# Altium schematic sheet Block_control.SchDoc
size 594 x 420 mm; SheetNumber: 1; SheetTotal: 1; PageSetup: Record=PageOptions|CenterHorizontal=True|CenterVertical=True|PrintScale=0.94|XCorrection=1.00|YCorrection=1.00|PrintKind=1|BorderSize=5000000|LeftOffset=0|BottomOffset=0|Orientation=1|PaperLength=1000|PaperWidth=1000|Scale=100|PaperSource=7|PrintQuality=-4|MediaType=1|DitherType=10|PaperKind=A4|PrintScaleMode=1; DecimalNumber: СМ7.82.00.00.00; HeadOfSector: Нач. сектора; MainDevice: Перв.примен.; Name: dffdfd; t_kontr: Т. контр; n_kontr: Н.Контр; lit_A: О; Name2: Наименование2; ListNumber: 1; Обозначение: СМ7.82.00.00.00 Э3; Наименование3: Схема электрическая принципиальная; Наименование1: Плата управления; Наименование2: приводами колес; Компания1: МГТУ им. Н. Э. Баумана; Компания2: группа СМ7-82Б; Разработал: Галиулин Н. С.; Проверил: Бошляков А. А.
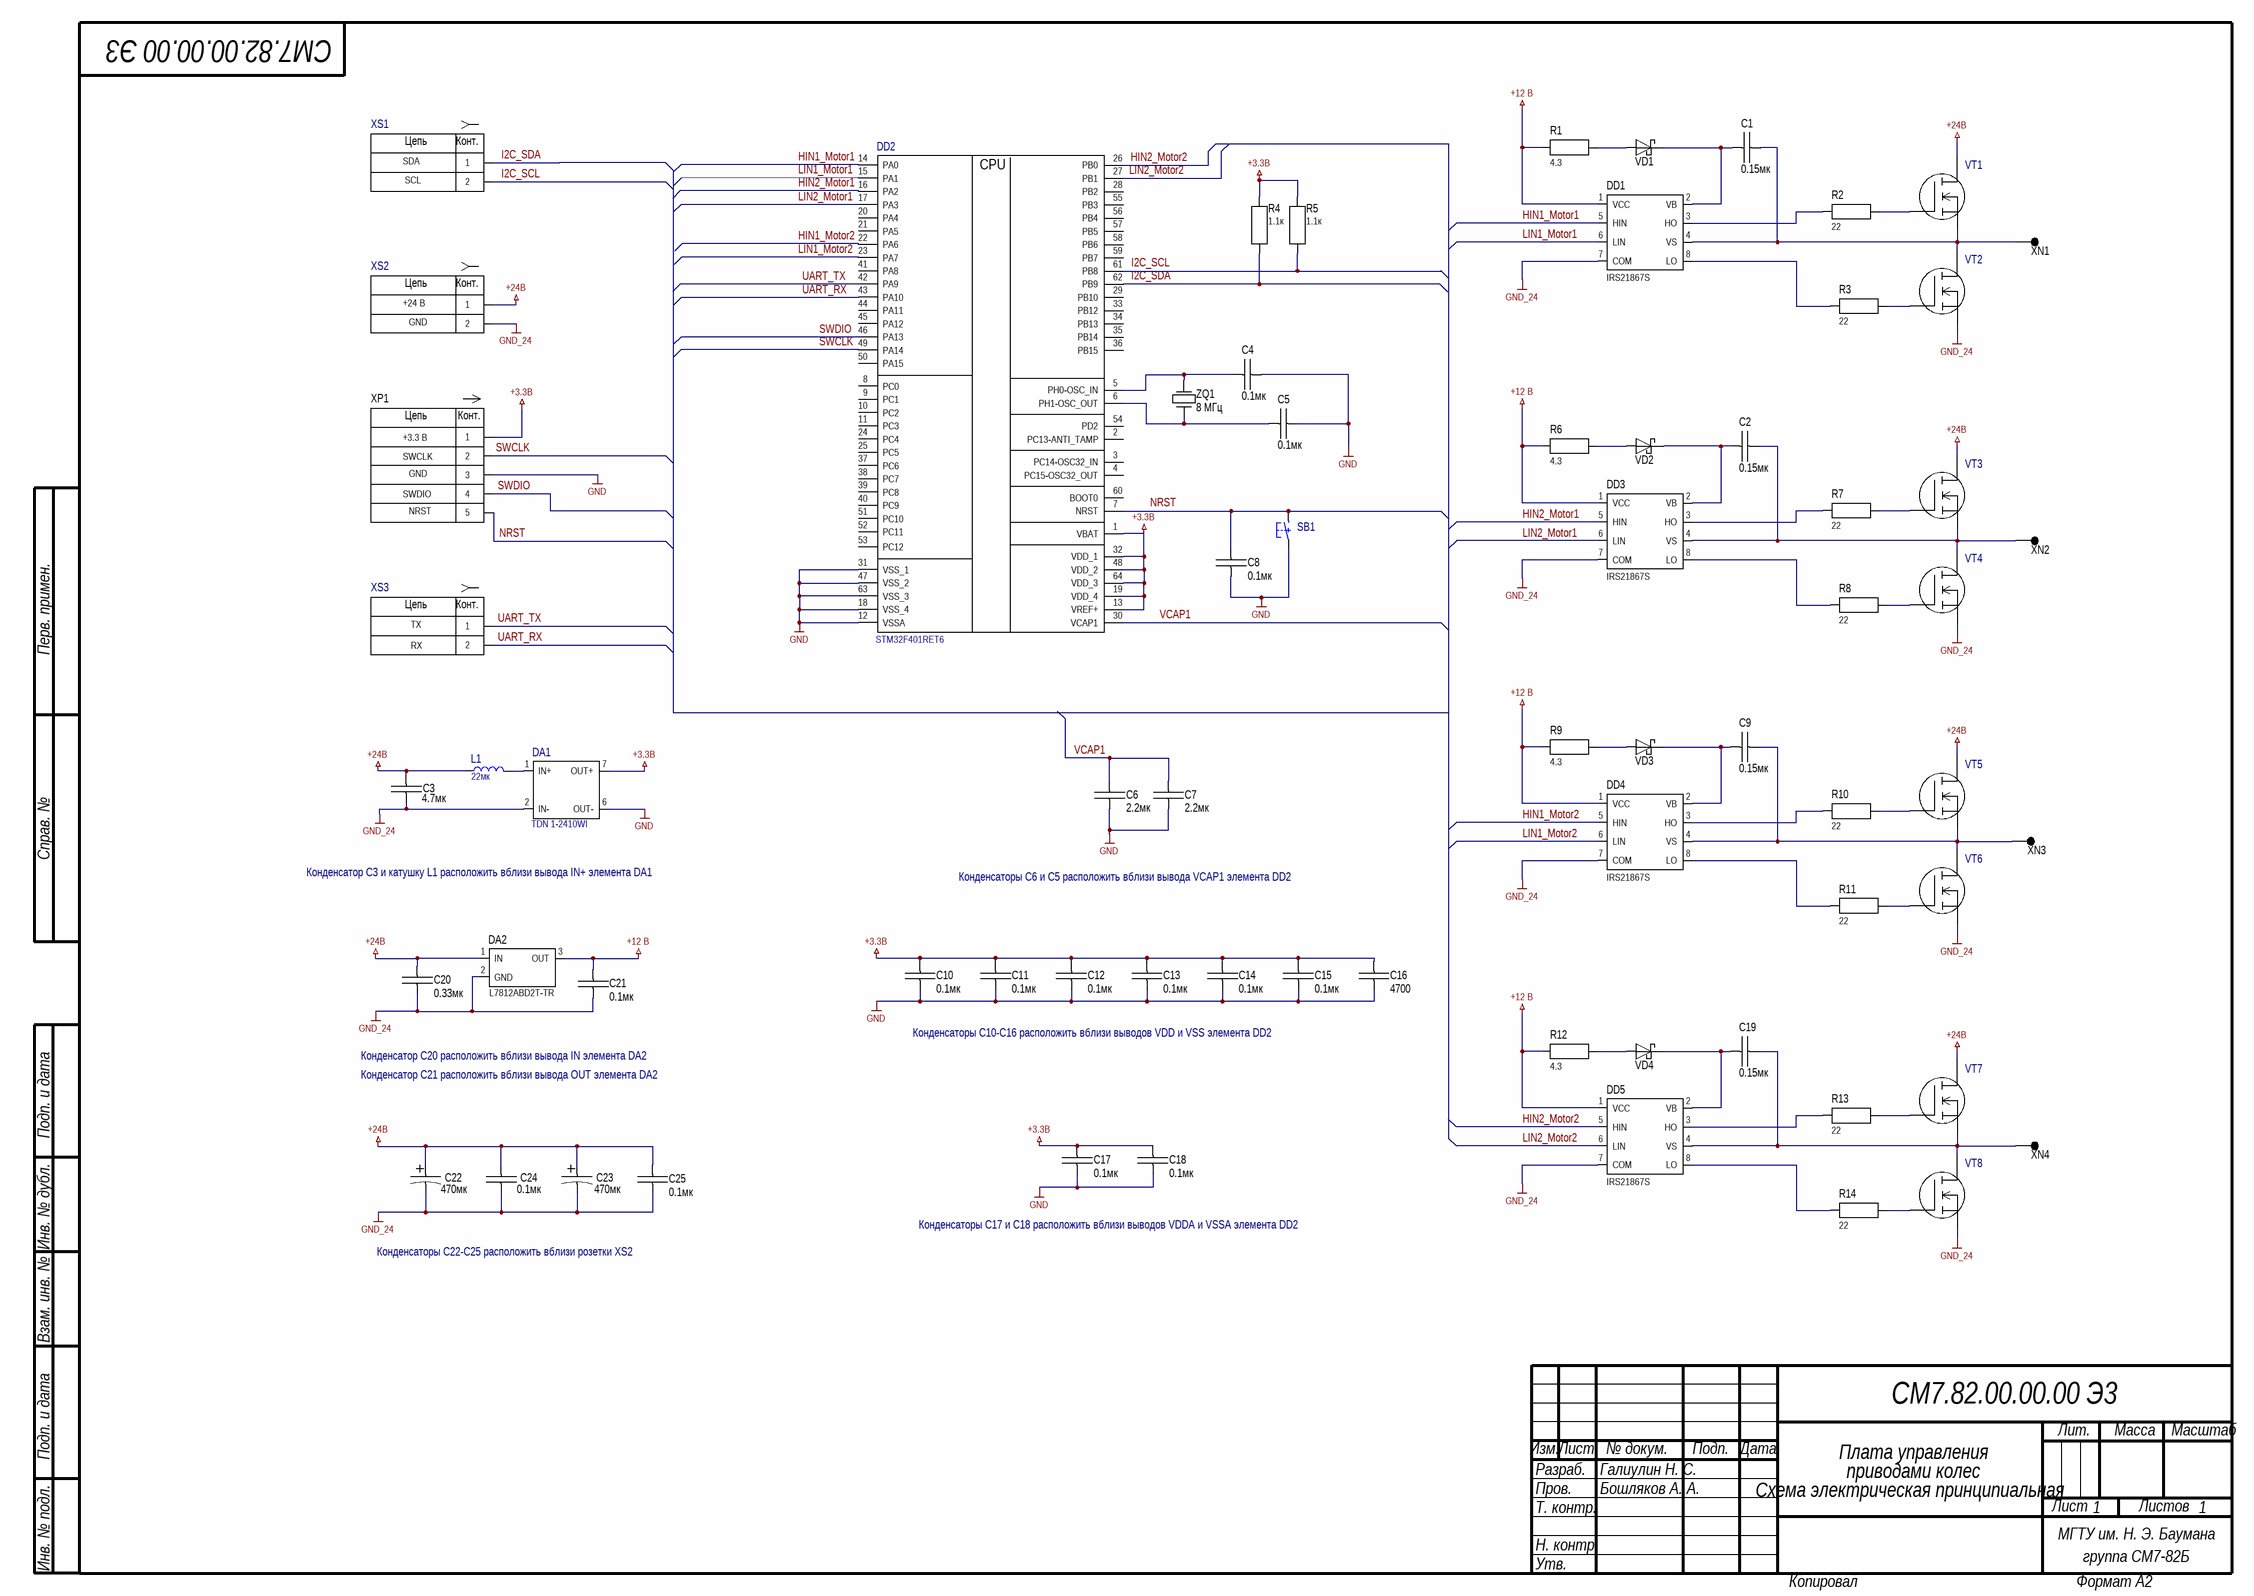
[diagram p0: Block_control.SchDoc]

## Parts
C1  value 0.15мк  [0603 Capicator]  (hidden comment: Cap_ceramica_SMD)
C2  value 0.15мк  [0603 Capicator]  (hidden comment: Cap_ceramica_SMD)
C3  value 4.7мк  [1206 Capacitor]  (hidden comment: Cap_ceramica_SMD)
C4  value 0.1мк  [0603 Capicator]  (hidden comment: Cap_ceramica_SMD)
C5  value 0.1мк  [0603 Capicator]  (hidden comment: Cap_ceramica_SMD)
C6  value 2.2мк  [0603 Capicator]  (hidden comment: Cap_ceramica_SMD)
C7  value 2.2мк  [0603 Capicator]  (hidden comment: Cap_ceramica_SMD)
C8  value 0.1мк  [0603 Capicator]  (hidden comment: Cap_ceramica_SMD)
C9  value 0.15мк  [0603 Capicator]  (hidden comment: Cap_ceramica_SMD)
C10  value 0.1мк  [0603 Capicator]  (hidden comment: Cap_ceramica_SMD)
C11  value 0.1мк  [0603 Capicator]  (hidden comment: Cap_ceramica_SMD)
C12  value 0.1мк  [0603 Capicator]  (hidden comment: Cap_ceramica_SMD)
C13  value 0.1мк  [0603 Capicator]  (hidden comment: Cap_ceramica_SMD)
C14  value 0.1мк  [0603 Capicator]  (hidden comment: Cap_ceramica_SMD)
C15  value 0.1мк  [0603 Capicator]  (hidden comment: Cap_ceramica_SMD)
C16  value 4700  [0603 Capicator]  (hidden comment: Cap_ceramica_SMD)
C17  value 0.1мк  [0603 Capicator]  (hidden comment: Cap_ceramica_SMD)
C18  value 0.1мк  [0603 Capicator]  (hidden comment: Cap_ceramica_SMD)
C19  value 0.15мк  [0603 Capicator]  (hidden comment: Cap_ceramica_SMD)
C20  value 0.33мк  [0603 Capicator]  (hidden comment: Cap_ceramica_SMD)
C21  value 0.1мк  [0603 Capicator]  (hidden comment: Cap_ceramica_SMD)
C22  470мк  [ECAP 8x16mm]
C23  470мк  [ECAP 8x16mm]
C24  value 0.1мк  [CAP: 0805 MIN_SILK]  (hidden comment: Cap_ceramica_SMD)
C25  value 0.1мк  [CAP: 0805 MIN_SILK]  (hidden comment: Cap_ceramica_SMD)
DA1  TDN 1-2410WI  [TDN 1-2410WI]
DA2  L7812ABD2T-TR  [D2-PAK (TO-262)]
DD1  Part Number: IRS21867S  [8-SOIC]  (hidden comment: IR2011STRPBF)
DD2  STM32F401RET6  [LQFP64]
DD3  Part Number: IRS21867S  [8-SOIC]  (hidden comment: IR2011STRPBF)
DD4  Part Number: IRS21867S  [8-SOIC]  (hidden comment: IR2011STRPBF)
DD5  Part Number: IRS21867S  [8-SOIC]  (hidden comment: IR2011STRPBF)
L1  22мк  [SDR]
R1  value 4.3  [RES: 0603 Min_Silk]  (hidden comment: 4.7)
R2  value 22  [RES: 0603 Min_Silk]  (hidden comment: 27)
R3  value 22  [RES: 0603 Min_Silk]  (hidden comment: 27)
R4  value 1.1к  [RES: 0603 Min_Silk]  (hidden comment: 27)
R5  value 1.1к  [RES: 0603 Min_Silk]  (hidden comment: 27)
R6  value 4.3  [RES: 0603 Min_Silk]  (hidden comment: 4.7)
R7  value 22  [RES: 0603 Min_Silk]  (hidden comment: 27)
R8  value 22  [RES: 0603 Min_Silk]  (hidden comment: 27)
R9  value 4.3  [RES: 0603 Min_Silk]  (hidden comment: 4.7)
R10  22  [RES: 0603 Min_Silk]
R11  22  [RES: 0603 Min_Silk]
R12  value 4.3  [RES: 0603 Min_Silk]  (hidden comment: 4.7)
R13  22  [RES: 0603 Min_Silk]
R14  22  [RES: 0603 Min_Silk]
SB1  But  [BUTTON 6x3.5]  (value not drawn)
VD1  Schottky Diode  [DIODE: SOD123LF]  (value not drawn)
VD2  Schottky Diode  [DIODE: SOD123LF]  (value not drawn)
VD3  Schottky Diode  [DIODE: SOD123LF]  (value not drawn)
VD4  Schottky Diode  [DIODE: SOD123LF]  (value not drawn)
VT1  IRL3705ZPBF  [TO-220]  (value not drawn)
VT2  IRL3705ZPBF  [TO-220]  (value not drawn)
VT3  IRL3705ZPBF  [TO-220]  (value not drawn)
VT4  IRL3705ZPBF  [TO-220]  (value not drawn)
VT5  IRL3705ZPBF  [TO-220]  (value not drawn)
VT6  IRL3705ZPBF  [TO-220]  (value not drawn)
VT7  IRL3705ZPBF  [TO-220]  (value not drawn)
VT8  IRL3705ZPBF  [TO-220]  (value not drawn)
XN1  Soldered connector  [CON: Pad 3mm]  (value not drawn)
XN2  Soldered connector  [CON: Pad 3mm]  (value not drawn)
XN3  Soldered connector  [CON: Pad 3mm]  (value not drawn)
XN4  Soldered connector  [CON: Pad 3mm]  (value not drawn)
XP1  Pin 4: GND  Pin 3: SWCLK  Pin 2: SWDIO  Pin 1: +3.3 В  [PLS 5x1]  (hidden comment: DS1021-1x5)
XS1  Micro-Fit 3.0  [MolexMicroFit 2x1]  (value not drawn)
XS2  Micro-Fit 3.0  [MolexMicroFit 2x1]  (value not drawn)
XS3  SCT1251WV-2P  [Con UART]  (value not drawn)
ZQ1  value 8 МГц  [R38]  (hidden comment: Oscillator (4 pin, 2 use))

## Nets
+3.3В: C10.2 C11.2 C12.2 C13.2 C14.2 C15.2 C16.2 C17.2 C18.2 DA1.7(OUT+) DD2.1(VBAT) DD2.13(VREF+) DD2.19(VDD_4) DD2.32(VDD_1) DD2.48(VDD_2) DD2.64(VDD_3) R4.2 R5.2 XP1.1
+12 В: C21.2 DA2.3(OUT) DD1.1(VCC) DD3.1(VCC) DD4.1(VCC) DD5.1(VCC) R1.1 R6.1 R9.1 R12.1
+24В: C3.2 C20.2 C22.2 C23.2 C24.2 C25.2 DA2.1(IN) L1.1 VT1.3(D1.1) VT3.3(D1.1) VT5.3(D1.1) VT7.3(D1.1) XS2.1
GND: C4.2 C5.2 C6.1 C7.1 C8.1 C10.1 C11.1 C12.1 C13.1 C14.1 C15.1 C16.1 C17.1 C18.1 DA1.6(OUT-) DD2.12(VSSA) DD2.18(VSS_4) DD2.31(VSS_1) DD2.47(VSS_2) DD2.63(VSS_3) SB1.1 XP1.3
GND_24: C3.1 C20.1 C21.1 C22.1 C23.1 C24.1 C25.1 DA1.2(IN-) DA2.2(GND) DD1.7(COM) DD3.7(COM) DD4.7(COM) DD5.7(COM) VT2.2(S1) VT4.2(S1) VT6.2(S1) VT8.2(S1) XS2.2
HIN1_Motor1: DD1.5(HIN) DD2.14(PA0)
HIN1_Motor2: DD2.22(PA6) DD4.5(HIN)
HIN2_Motor1: DD2.16(PA2) DD3.5(HIN)
HIN2_Motor2: DD2.26(PB0) DD5.5(HIN)
I2C_SCL: XS1.2
I2C_SDA: XS1.1
LIN1_Motor1: DD1.6(LIN) DD2.15(PA1)
LIN1_Motor2: DD2.23(PA7) DD4.6(LIN)
LIN2_Motor1: DD2.17(PA3) DD3.6(LIN)
LIN2_Motor2: DD2.27(PB1) DD5.6(LIN)
NRST: XP1.5
SWCLK: DD2.49(PA14) XP1.2
SWDIO: DD2.46(PA13) XP1.4
UART_RX: DD2.43(PA10) XS3.2
UART_TX: DD2.42(PA9) XS3.1
VCAP1: C6.2 C7.2 DD2.30(VCAP1)
NetC1_1: C1.1 DD1.2(VB) VD1.1
NetC1_2: C1.2 DD1.4(VS) VT1.2(S1) VT2.3(D1.1) XN1.1
NetC2_1: C2.1 DD3.2(VB) VD2.1
NetC2_2: C2.2 DD3.4(VS) VT3.2(S1) VT4.3(D1.1) XN2.1
NetC4_1: C4.1 DD2.5(PH0-OSC_IN) ZQ1.2
NetC5_1: C5.1 DD2.6(PH1-OSC_OUT) ZQ1.1
NetC8_2: C8.2 DD2.7(NRST) SB1.2
NetC9_1: C9.1 DD4.2(VB) VD3.1
NetC9_2: C9.2 DD4.4(VS) VT5.2(S1) VT6.3(D1.1) XN3.1
NetC19_1: C19.1 DD5.2(VB) VD4.1
NetC19_2: C19.2 DD5.4(VS) VT7.2(S1) VT8.3(D1.1) XN4.1
NetDA1_1: DA1.1(IN+) L1.2
NetDD1_3: DD1.3(HO) R2.1
NetDD1_8: DD1.8(LO) R3.1
NetDD2_61: DD2.61(PB8) R5.1
NetDD2_62: DD2.62(PB9) R4.1
NetDD3_3: DD3.3(HO) R7.1
NetDD3_8: DD3.8(LO) R8.1
NetDD4_3: DD4.3(HO) R10.1
NetDD4_8: DD4.8(LO) R11.1
NetDD5_3: DD5.3(HO) R13.1
NetDD5_8: DD5.8(LO) R14.1
NetR1_2: R1.2 VD1.2
NetR2_2: R2.2 VT1.1(G1)
NetR3_2: R3.2 VT2.1(G1)
NetR6_2: R6.2 VD2.2
NetR7_2: R7.2 VT3.1(G1)
NetR8_2: R8.2 VT4.1(G1)
NetR9_2: R9.2 VD3.2
NetR10_2: R10.2 VT5.1(G1)
NetR11_2: R11.2 VT6.1(G1)
NetR12_2: R12.2 VD4.2
NetR13_2: R13.2 VT7.1(G1)
NetR14_2: R14.2 VT8.1(G1)

Not connected (* = marked no-connect by the designer): DD2 2(PC13-ANTI_TAMP) 3(PC14-OSC32_IN) 4(PC15-OSC32_OUT) 8(PC0) 9(PC1) 10(PC2) 11(PC3) 20(PA4) 21(PA5) 24(PC4) 25(PC5) 28(PB2) 29(PB10) 33(PB12) 34(PB13) 35(PB14) 36(PB15) 37(PC6) 38(PC7) 39(PC8) 40(PC9) 41(PA8) 44(PA11) 45(PA12) 50(PA15) 51(PC10) 52(PC11) 53(PC12) 54(PD2) 55(PB3) 56(PB4) 57(PB5) 58(PB6) 59(PB7) 60(BOOT0)

## Notes on the sheet
- Конденсатор C3 и катушку L1 расположить вблизи вывода IN+ элемента DA1
- Конденсаторы C6 и С5 расположить вблизи вывода VCAP1 элемента DD2
- Конденсатор C20 расположить вблизи вывода IN элемента DA2
- Конденсатор C21 расположить вблизи вывода OUT элемента DA2
- Конденсаторы C10-C16 расположить вблизи выводов VDD и VSS элемента DD2
- Конденсаторы C22-С25 расположить вблизи розетки XS2
- Конденсаторы C17 и С18 расположить вблизи выводов VDDA и VSSA элемента DD2
- Labels drawn without touching a wire or pin: I2C_SCL, I2C_SDA, NRST
- Перв. примен.
- Справ. №
- Подп. и дата
- Инв. № дубл.
- Взам. инв. №
- Разраб.
- Изм.
- Лист
- № докум.
- Подп.
- Дата
- Лит.
- Масса
- Масштаб
- Пров.
- Т. контр.
- Листов
- Инв. № подл.
- Н. контр.
- Утв.
- Копировал
- Формат А2
- (in symbol 4-pin (Female)) Цепь; Конт.; NRST
- (in symbol Con 2 MicroFit) Цепь; Конт.; +24 В; GND
- (in symbol Con I2C) Цепь; Конт.; SDA; SCL
- (in symbol Con UART) Цепь; Конт.; TX; RX
- (in symbol STM32F401RET6) CPU

## Library data of the parts
C1-C15 C17-C21 C24 C25 = Cap_ceramica_SMD_2: Capacitor ceramic SMD; Part Number: CL05B104KP5NNNC; Voltage: 10
C16 = Cap_ceramica_SMD_1: Capacitor ceramic SMD; Part Number: CL05B471KB5NNNC; Voltage: 50
C22 C23 = ECAP
DA1 = TDL 2-2410
DA2 = L7812ABD2T-TR: LDO Regulator; Part Number: L7812ABD2T-TR
DD1 DD3-DD5 = IR2011STRPBF: HIGH AND LOW SIDE DRIVER
L1 = Inductor 10uH (1.5A): 10uH, D=5.8mm, 1450mA; Part Number: SDR0604-100ML; Manufacturer: TCK-130 | TRACOPOWER; Type: Inductor; ComponentLink1Description: DataSheet; ComponentLink1URL: http://www.farnell.com/datasheets/1635216.pdf; ComponentLink2Description: Chip&Dip; ComponentLink2URL: https://www.chipdip.ru/product/sdr0604-100ml
R1-R14 = Resistor_SMD_1: Resistor SMD; Part Number: ERJPA3J1R8V
  R10 R11 R13 R14: Value: 22
SB1 = Button 2 Conn: Button 2 Conn SMD; Part Number: L-KLS7-TS3608-5.0-180; Manufacturer: KLS electronic co ltd; Type: Button; ComponentLink1Description: Chip&Dip; ComponentLink1URL: https://www.chipdip.ru/product/kls7-ts3608-5.0-180-td-02xa
VD1-VD4 = Schottky Diode: Part Number: MBR130LSFT1G
VT1-VT8 = MOSFET
XP1 = 4-pin (Female): Part Number: PBS-4
XS1 = Con I2C: Parameter 1: 0603
XS2 = Con 2 MicroFit
XS3 = Con UART
ZQ1 = Oscillator (4 pin, 2 use): Quartz Crystal; Part Number: 1C208000CE0Q